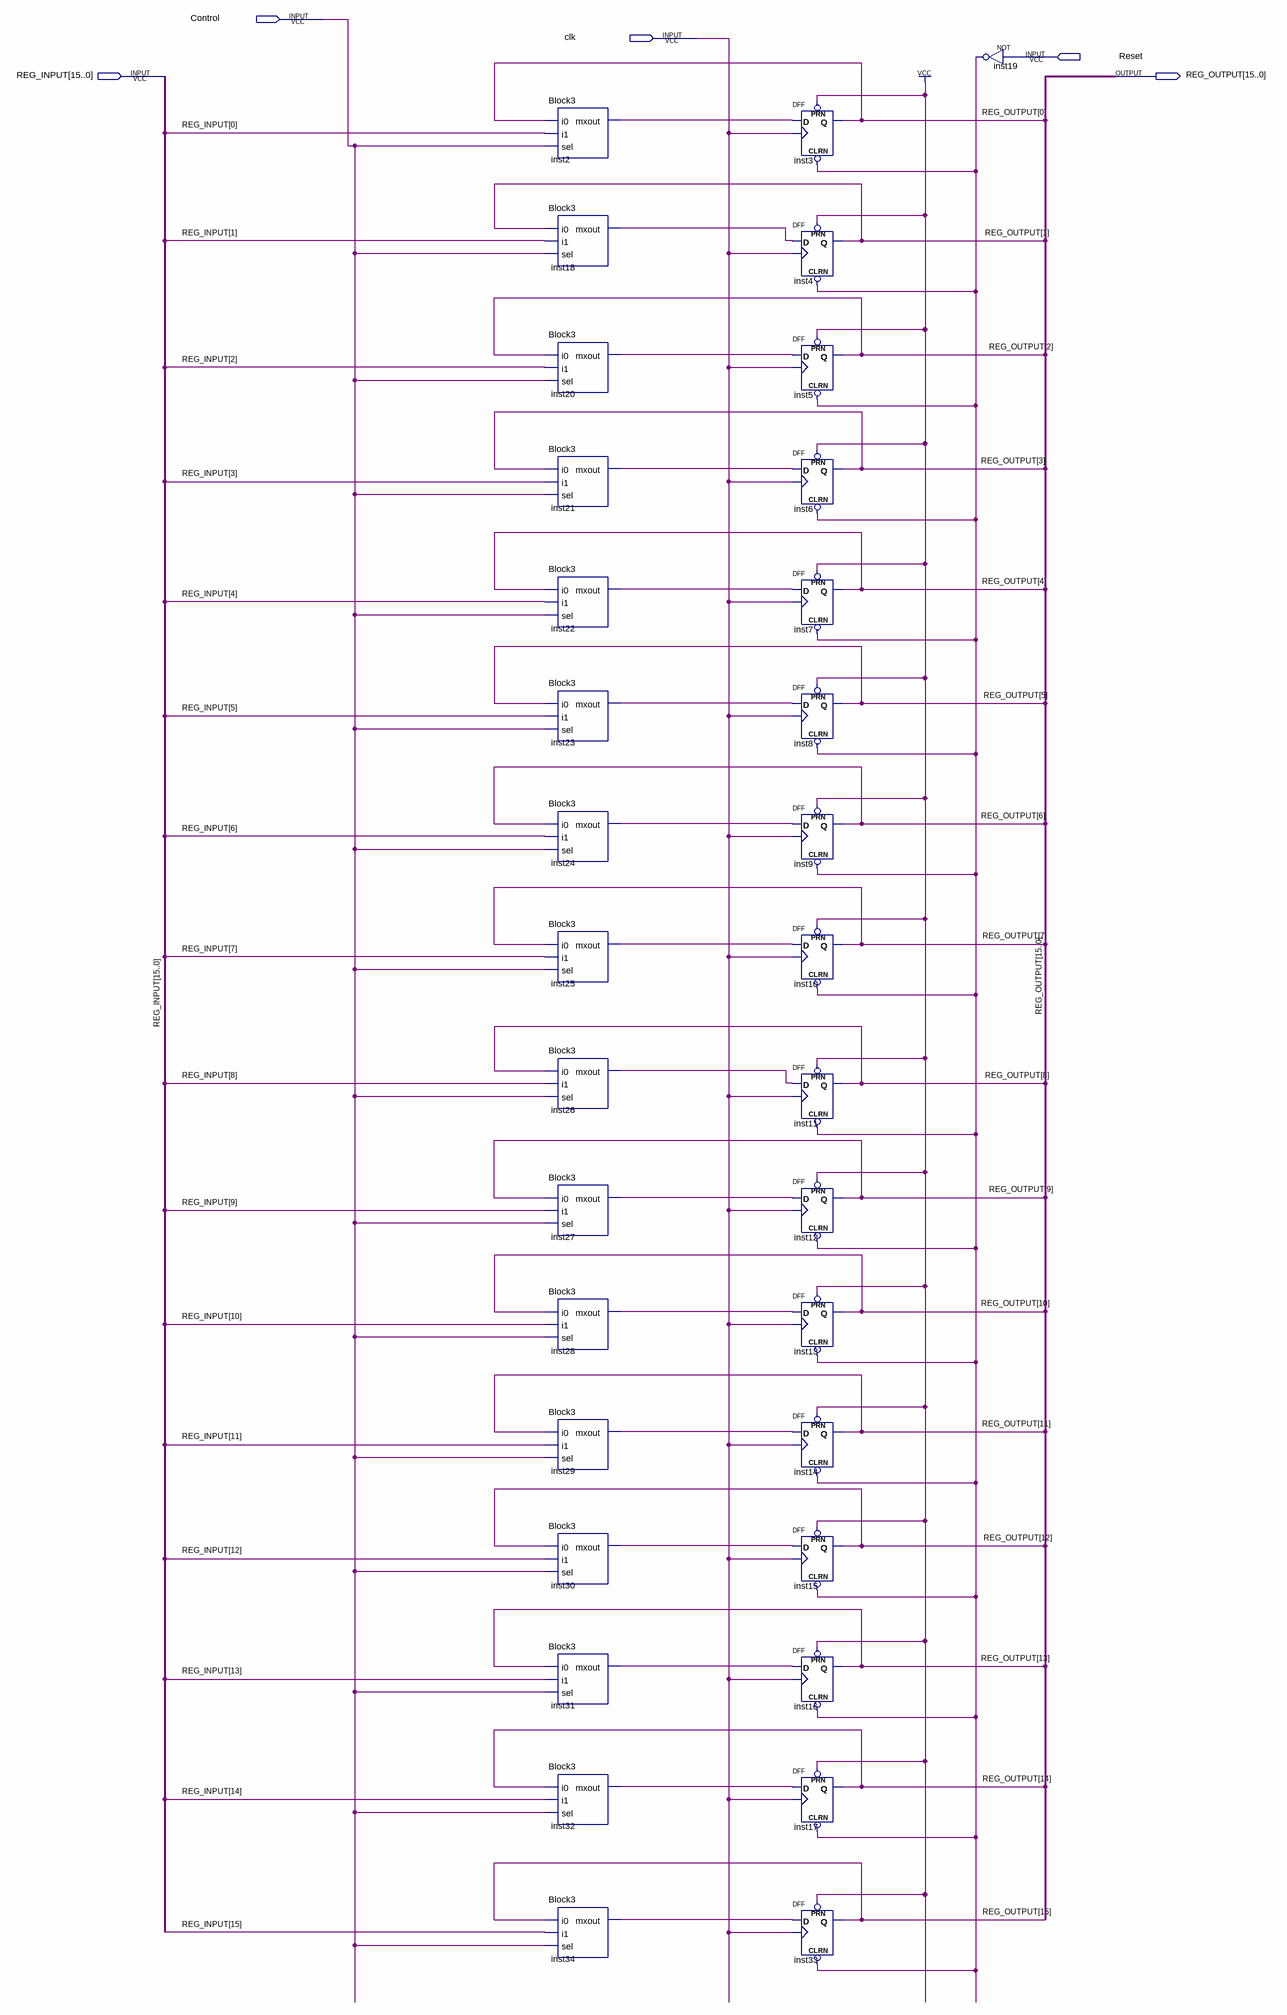
[diagram p0: schematic sheet]
// Quartus schematic Registers16bit.bdf as structural Verilog: 33 symbols, 5 pins
module Registers16bit (
  input  Control,
  input  clk,
  input  Reset,
  input  [15:0] REG_INPUT,
  output [15:0] REG_OUTPUT
);

  wire inst2_mxout, inst18_mxout, inst19_out, inst20_mxout, inst21_mxout, inst22_mxout, inst23_mxout,
       inst24_mxout, inst25_mxout, inst26_mxout, inst27_mxout, inst28_mxout, inst29_mxout, inst30_mxout,
       inst31_mxout, inst32_mxout, inst34_mxout;

  Block3 inst2 (.i0(REG_OUTPUT[0]), .i1(REG_INPUT[0]), .sel(Control), .mxout(inst2_mxout));
  Block3 inst18 (.i0(REG_OUTPUT[1]), .i1(REG_INPUT[1]), .sel(Control), .mxout(inst18_mxout));
  Block3 inst20 (.i0(REG_OUTPUT[2]), .i1(REG_INPUT[2]), .sel(Control), .mxout(inst20_mxout));
  Block3 inst21 (.i0(REG_OUTPUT[3]), .i1(REG_INPUT[3]), .sel(Control), .mxout(inst21_mxout));
  Block3 inst22 (.i0(REG_OUTPUT[4]), .i1(REG_INPUT[4]), .sel(Control), .mxout(inst22_mxout));
  Block3 inst23 (.i0(REG_OUTPUT[5]), .i1(REG_INPUT[5]), .sel(Control), .mxout(inst23_mxout));
  Block3 inst24 (.i0(REG_OUTPUT[6]), .i1(REG_INPUT[6]), .sel(Control), .mxout(inst24_mxout));
  Block3 inst25 (.i0(REG_OUTPUT[7]), .i1(REG_INPUT[7]), .sel(Control), .mxout(inst25_mxout));
  Block3 inst26 (.i0(REG_OUTPUT[8]), .i1(REG_INPUT[8]), .sel(Control), .mxout(inst26_mxout));
  Block3 inst27 (.i0(REG_OUTPUT[9]), .i1(REG_INPUT[9]), .sel(Control), .mxout(inst27_mxout));
  Block3 inst28 (.i0(REG_OUTPUT[10]), .i1(REG_INPUT[10]), .sel(Control), .mxout(inst28_mxout));
  Block3 inst29 (.i0(REG_OUTPUT[11]), .i1(REG_INPUT[11]), .sel(Control), .mxout(inst29_mxout));
  Block3 inst30 (.i0(REG_OUTPUT[12]), .i1(REG_INPUT[12]), .sel(Control), .mxout(inst30_mxout));
  Block3 inst31 (.i0(REG_OUTPUT[13]), .i1(REG_INPUT[13]), .sel(Control), .mxout(inst31_mxout));
  Block3 inst32 (.i0(REG_OUTPUT[14]), .i1(REG_INPUT[14]), .sel(Control), .mxout(inst32_mxout));
  Block3 inst34 (.i0(REG_OUTPUT[15]), .i1(REG_INPUT[15]), .sel(Control), .mxout(inst34_mxout));
  DFF inst3 (.CLRN(inst19_out), .CLK(clk), .D(inst2_mxout), .PRN(1'b1), .Q(REG_OUTPUT[0]));
  DFF inst4 (.CLRN(inst19_out), .CLK(clk), .D(inst18_mxout), .PRN(1'b1), .Q(REG_OUTPUT[1]));
  DFF inst5 (.CLRN(inst19_out), .CLK(clk), .D(inst20_mxout), .PRN(1'b1), .Q(REG_OUTPUT[2]));
  DFF inst6 (.CLRN(inst19_out), .CLK(clk), .D(inst21_mxout), .PRN(1'b1), .Q(REG_OUTPUT[3]));
  DFF inst7 (.CLRN(inst19_out), .CLK(clk), .D(inst22_mxout), .PRN(1'b1), .Q(REG_OUTPUT[4]));
  DFF inst8 (.CLRN(inst19_out), .CLK(clk), .D(inst23_mxout), .PRN(1'b1), .Q(REG_OUTPUT[5]));
  DFF inst9 (.CLRN(inst19_out), .CLK(clk), .D(inst24_mxout), .PRN(1'b1), .Q(REG_OUTPUT[6]));
  DFF inst10 (.CLRN(inst19_out), .CLK(clk), .D(inst25_mxout), .PRN(1'b1), .Q(REG_OUTPUT[7]));
  DFF inst11 (.CLRN(inst19_out), .CLK(clk), .D(inst26_mxout), .PRN(1'b1), .Q(REG_OUTPUT[8]));
  DFF inst12 (.CLRN(inst19_out), .CLK(clk), .D(inst27_mxout), .PRN(1'b1), .Q(REG_OUTPUT[9]));
  DFF inst13 (.CLRN(inst19_out), .CLK(clk), .D(inst28_mxout), .PRN(1'b1), .Q(REG_OUTPUT[10]));
  DFF inst14 (.CLRN(inst19_out), .CLK(clk), .D(inst29_mxout), .PRN(1'b1), .Q(REG_OUTPUT[11]));
  DFF inst15 (.CLRN(inst19_out), .CLK(clk), .D(inst30_mxout), .PRN(1'b1), .Q(REG_OUTPUT[12]));
  DFF inst16 (.CLRN(inst19_out), .CLK(clk), .D(inst31_mxout), .PRN(1'b1), .Q(REG_OUTPUT[13]));
  DFF inst17 (.CLRN(inst19_out), .CLK(clk), .D(inst32_mxout), .PRN(1'b1), .Q(REG_OUTPUT[14]));
  DFF inst33 (.CLRN(inst19_out), .CLK(clk), .D(inst34_mxout), .PRN(1'b1), .Q(REG_OUTPUT[15]));
  not inst19 (inst19_out, Reset);
endmodule
